# EAGLE design 808_CY (EAGLE 7.1.0)
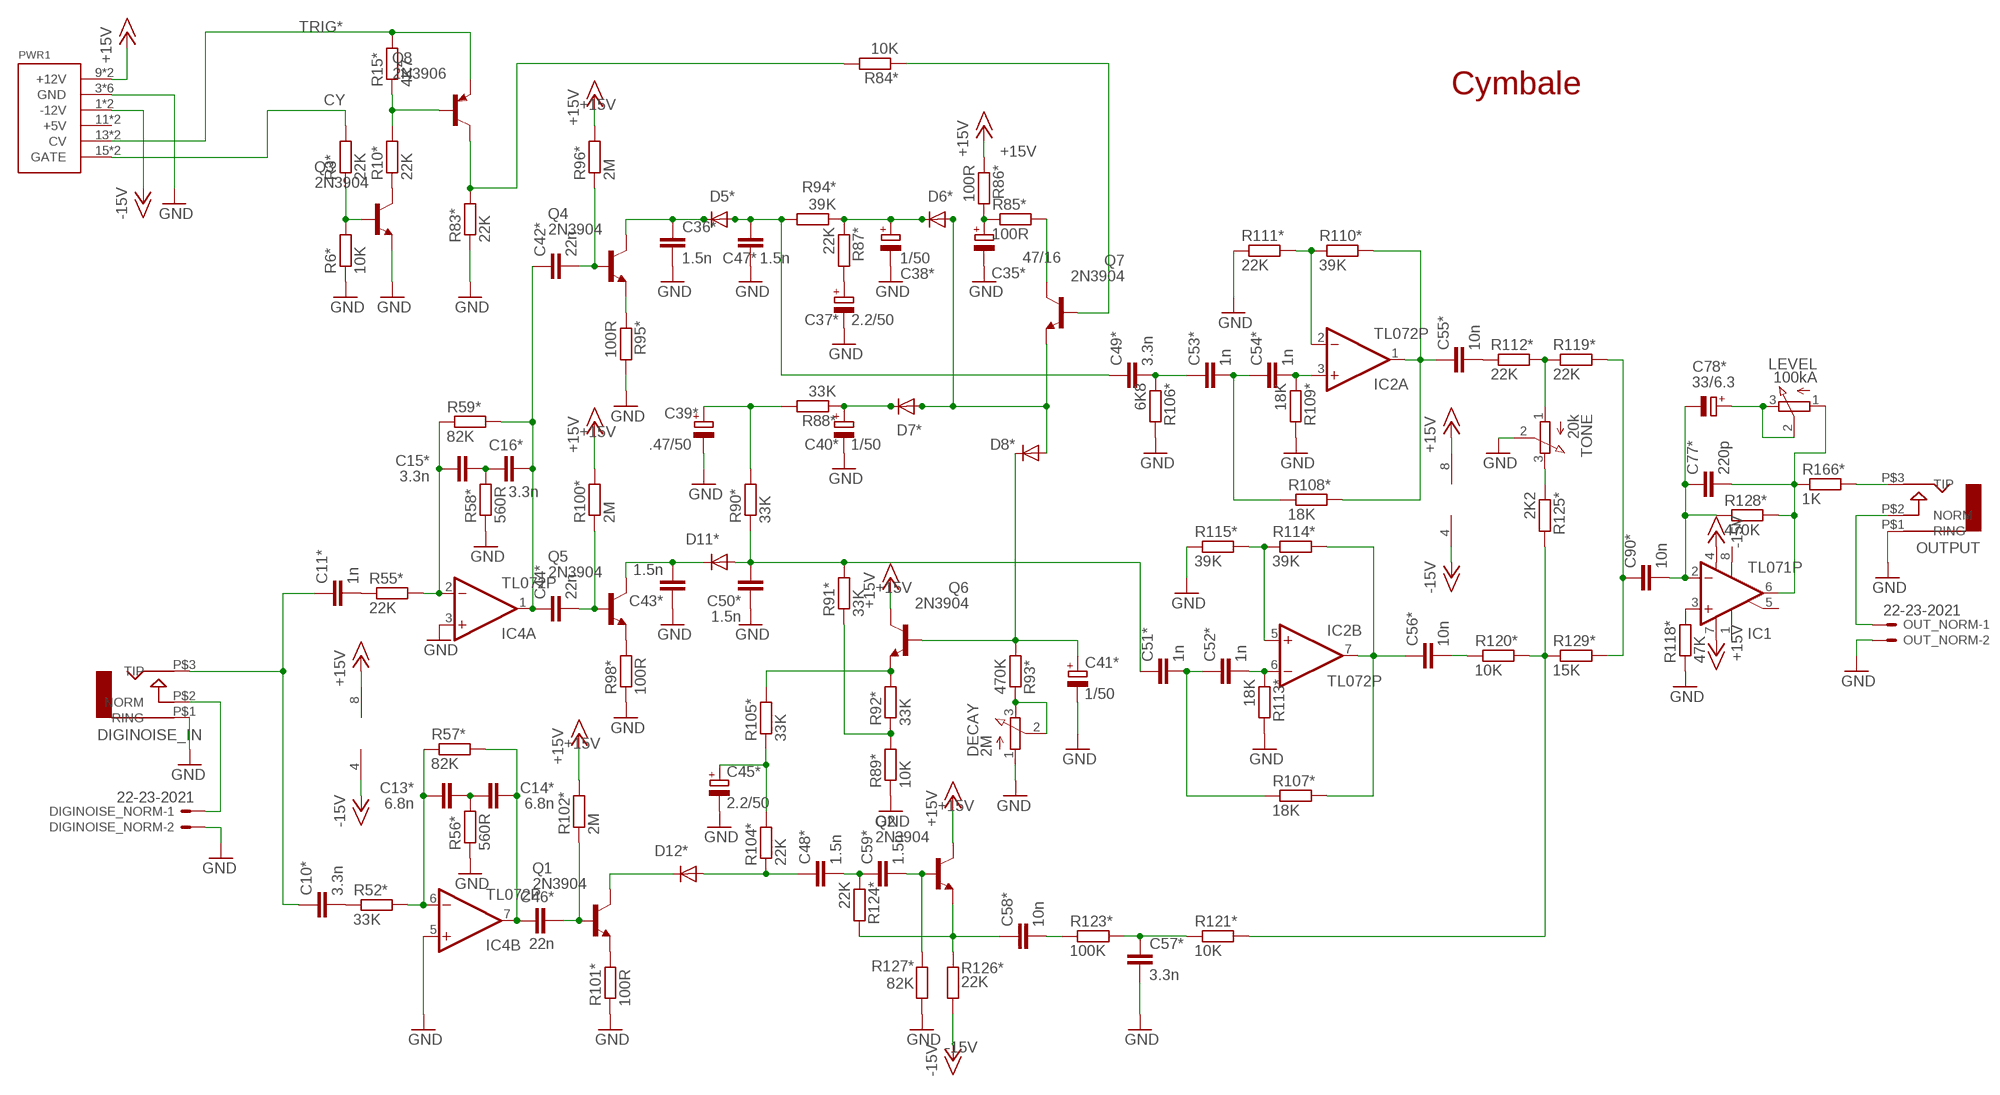
[diagram p0: schematic, sheet 1]

## Parts
C10*  3.3n  C-EU3.5MM_PITCH  [C035-025X75]
C11*  1n  C-EU3.5MM_PITCH  [C035-025X75]
C13*  6.8n  C-EU4MM_PITCH  [C035-030X60]
C14*  6.8n  C-EU4MM_PITCH  [C035-030X60]
C15*  3.3n  C-EU3.5MM_PITCH  [C035-025X75]
C16*  3.3n  C-EU3.5MM_PITCH  [C035-025X75]
C35*  47/16  CPOL-EUE2.5-5  [E2,5-5]
C36*  1.5n  C-EU3.5MM_PITCH  [C035-025X75]
C37*  2.2/50  CPOL-EUE2.5-5  [E2,5-5]
C38*  1/50  CPOL-EUE2.5-5  [E2,5-5]
C39*  .47/50  CPOL-EUE2.5-5  [E2,5-5]
C40*  1/50  CPOL-EUE2.5-5  [E2,5-5]
C41*  1/50  CPOL-EUE3.5-8  [E3,5-8]
C42*  22n  C-EU050-024X044  [C050-024X044]
C43*  1.5n  C-EU3.5MM_PITCH  [C035-025X75]
C44*  22n  C-EU050-024X044  [C050-024X044]
C45*  2.2/50  CPOL-EUE2.5-5  [E2,5-5]
C46*  22n  C-EU050-024X044  [C050-024X044]
C47*  1.5n  C-EU050-035X075  [C050-035X075]
C48*  1.5n  C-EU3.5MM_PITCH  [C035-025X75]
C49*  3.3n  C-EU3.5MM_PITCH  [C035-025X75]
C50*  1.5n  C-EU3.5MM_PITCH  [C035-025X75]
C51*  1n  C-EU3.5MM_PITCH  [C035-025X75]
C52*  1n  C-EU3.5MM_PITCH  [C035-025X75]
C53*  1n  C-EU3.5MM_PITCH  [C035-025X75]
C54*  1n  C-EU3.5MM_PITCH  [C035-025X75]
C55*  10n  C-EU050-030X075  [C050-030X075]
C56*  10n  C-EU3.5MM_PITCH  [C035-025X75]
C57*  3.3n  C-EU3.5MM_PITCH  [C035-025X75]
C58*  10n  C-EU3.5MM_PITCH  [C035-025X75]
C59*  1.5n  C-EU3.5MM_PITCH  [C035-025X75]
C77*  220p  C-EU025-025X050  [C025-025X050]
C78*  33/6.3  CPOL-EUE3.5-8  [E3,5-8]
C90*  10n  C-EU3.5MM_PITCH  [C035-025X75]
D5*  1N4148DO35-10  [DO35-10]
D6*  1N4148DO35-7  [DO35-7]
D7*  1N4148DO35-7  [DO35-7]
D8*  1N4148DO35-7  [DO35-7]
D11*  1N4148DO35-7  [DO35-7]
D12*  1N4148DO35-7  [DO35-7]
DECAY  2M  3RP/1610N  [3RP/1610N]
DIGINOISE_IN  AUDIO-JACK  [ERTHENVAR-JACK-90DEG]
DIGINOISE_NORM  22-23-2021  [22-23-2021]
IC1  TL071P  [DIL08]
IC2  TL072P  [DIL08]
IC4  TL072P  [DIL08]
LEVEL  100kA  3RP/1610N  [3RP/1610N]
OUT_NORM  22-23-2021  [22-23-2021]
OUTPUT  AUDIO-JACK  [ERTHENVAR-JACK-90DEG]
PWR1  POWER  [POWER_16]
Q1  2N3904  [TO92]
Q2  2N3904  [TO92]
Q3  2N3904  [TO92]
Q4  2N3904  [TO92]
Q5  2N3904  [TO92]
Q6  2N3904  [TO92]
Q7  2N3904  [TO92]
Q8  2N3906  [TO92]
R3*  22K  R-EU_0207/5V  [0207/5V]
R6*  10K  R-EU_0207/5V  [0207/5V]
R10*  22K  R-EU_0207/5V  [0207/5V]
R15*  4K7  R-EU_0207/5V  [0207/5V]
R52*  33K  R-EU_0207/5V  [0207/5V]
R55*  22K  R-EU_0207/7  [0207/7]
R56*  560R  R-EU_0207/5V  [0207/5V]
R57*  82K  R-EU_0207/5V  [0207/5V]
R58*  560R  R-EU_0207/7  [0207/7]
R59*  82K  R-EU_0207/2V  [0207/2V]
R83*  22K  R-EU_0207/5V  [0207/5V]
R84*  10K  R-EU_0207/7  [0207/7]
R85*  100R  R-EU_0207/7  [0207/7]
R86*  100R  R-EU_0207/7  [0207/7]
R87*  22K  R-EU_0207/5V  [0207/5V]
R88*  33K  R-EU_0207/5V  [0207/5V]
R89*  10K  R-EU_0207/7  [0207/7]
R90*  33K  R-EU_0207/5V  [0207/5V]
R91*  33K  R-EU_0207/7  [0207/7]
R92*  33K  R-EU_0207/7  [0207/7]
R93*  470K  R-EU_0207/7  [0207/7]
R94*  39K  R-EU_0207/5V  [0207/5V]
R95*  100R  R-EU_0207/7  [0207/7]
R96*  2M  R-EU_0207/5V  [0207/5V]
R98*  100R  R-EU_0207/7  [0207/7]
R100*  2M  R-EU_0207/7  [0207/7]
R101*  100R  R-EU_0207/7  [0207/7]
R102*  2M  R-EU_0207/7  [0207/7]
R104*  22K  R-EU_0207/5V  [0207/5V]
R105*  33K  R-EU_0309/10  [0309/10]
R106*  6K8  R-EU_0207/5V  [0207/5V]
R107*  18K  R-EU_0207/5V  [0207/5V]
R108*  18K  R-EU_0207/5V  [0207/5V]
R109*  18K  R-EU_0207/7  [0207/7]
R110*  39K  R-EU_0207/7  [0207/7]
R111*  22K  R-EU_0207/7  [0207/7]
R112*  22K  R-EU_0207/5V  [0207/5V]
R113*  18K  R-EU_0207/7  [0207/7]
R114*  39K  R-EU_0207/5V  [0207/5V]
R115*  39K  R-EU_0207/7  [0207/7]
R118*  47K  R-EU_0207/5V  [0207/5V]
R119*  22K  R-EU_0207/5V  [0207/5V]
R120*  10K  R-EU_0207/5V  [0207/5V]
R121*  10K  R-EU_0207/7  [0207/7]
R123*  100K  R-EU_0207/7  [0207/7]
R124*  22K  R-EU_0207/5V  [0207/5V]
R125*  2K2  R-EU_0207/5V  [0207/5V]
R126*  22K  R-EU_0207/7  [0207/7]
R127*  82K  R-EU_0207/5V  [0207/5V]
R128*  470K  R-EU_0207/5V  [0207/5V]
R129*  15K  R-EU_0207/5V  [0207/5V]
R166*  1K  R-EU_0207/7  [0207/7]
TONE  20k  3RP/1610N  [3RP/1610N]

## Nets
+15V: IC1.7(V+) IC2.8(P:V+) IC4.8(P:V+) PWR1.9(+12V) PWR1.10(+12V) Q2.1(C) Q6.1(C) R86*.1 R96*.2 R100*.2 R102*.2
-15V: IC1.4(V-) IC2.4(P:V-) IC4.4(P:V-) PWR1.1(-12V) PWR1.2(-12V) R126*.2
CY: PWR1.15(GATE) PWR1.16(GATE) R3*.2
GND [GND]: C35*.- C36*.P$2 C37*.- C38*.- C39*.- C40*.- C41*.- C43*.P$1 C45*.- C47*.2 C50*.P$1 C57*.P$2 DECAY.1(A) DIGINOISE_IN.P$1(RING) DIGINOISE_NORM.2 IC4.3(A:+IN) IC4.5(B:+IN) OUT_NORM.2 OUTPUT.P$1(RING) PWR1.3(GND) PWR1.4(GND) PWR1.5(GND) PWR1.6(GND) PWR1.7(GND) PWR1.8(GND) Q3.3(E) R6*.1 R56*.1 R58*.1 R83*.1 R89*.1 R95*.2 R98*.1 R101*.1 R106*.2 R109*.2 R111*.1 R113*.2 R115*.1 R118*.1 R127*.2 TONE.2(S)
LT_LC_OUT1: C10*.P$1 C11*.P$1 DIGINOISE_IN.P$3(TIP)
N$1: Q5.3(E) R98*.2
N$2: Q1.3(E) R101*.2
N$3: Q3.1(C) R10*.1
N$4: IC1.3(+IN) R118*.2
N$5: OUT_NORM.1 OUTPUT.P$2(NORM)
N$6: DIGINOISE_IN.P$2(NORM) DIGINOISE_NORM.1
N$7: OUTPUT.P$3(TIP) R166*.2
N$171: C78*.+ LEVEL.2(S) LEVEL.3(E)
N$177: C58*.P$1 Q2.3(E) R124*.2 R126*.1
N$178: DECAY.2(S) DECAY.3(E) R93*.1
N$216: Q4.3(E) R95*.1
N$223: C50*.P$2 C51*.P$1 D11*.A R90*.1 R91*.2
N$495: C11*.P$2 R55*.1
N$496: C15*.P$1 IC4.2(A:-IN) R55*.2 R59*.1
N$498: C44*.2 Q5.2(B) R100*.1
N$500: C43*.P$2 D11*.C Q5.1(C)
N$501: C39*.+ R88*.2 R90*.2
N$502: C10*.P$2 R52*.1
N$503: C13*.P$1 IC4.6(B:-IN) R52*.2 R57*.1
N$504: C14*.P$2 C46*.1 IC4.7(B:OUT) R57*.2
N$505: C46*.2 Q1.2(B) R102*.1
N$507: D12*.C Q1.1(C)
N$508: C48*.P$1 D12*.A R104*.1
N$510: C40*.+ D7*.C R88*.1
N$511: C35*.+ R85*.1 R86*.2
N$512: Q7.1(C) R85*.2
N$513: D6*.A D7*.A D8*.A Q7.3(E)
N$514: Q7.2(B) R84*.1
N$515: Q8.1(C) R83*.2 R84*.2
N$516: Q8.2(B) R10*.2 R15*.1
N$517: Q3.2(B) R3*.1 R6*.2
N$522: C36*.P$1 D5*.C Q4.1(C)
N$523: C47*.1 C49*.P$1 D5*.A R94*.2
N$524: C42*.2 Q4.2(B) R96*.1
N$526: C37*.+ R87*.2
N$527: Q6.3(E) R92*.2 R105*.2
N$528: R89*.2 R91*.1 R92*.1
N$529: C41*.+ D8*.C Q6.2(B) R93*.2
N$530: C49*.P$2 C53*.P$1 R106*.1
N$531: C54*.P$2 IC2.3(A:+IN) R109*.1
N$532: R112*.2 R119*.1 TONE.1(A)
N$533: C55*.1 IC2.1(A:OUT) R108*.2 R110*.2
N$534: C53*.P$2 C54*.P$1 R108*.1
N$535: IC2.2(A:-IN) R110*.1 R111*.2
N$536: C55*.2 R112*.1
N$537: R125*.1 TONE.3(E)
N$538: C52*.P$2 IC2.6(B:-IN) R113*.1
N$539: C56*.P$1 IC2.7(B:OUT) R107*.2 R114*.2
N$540: C51*.P$2 C52*.P$1 R107*.1
N$541: IC2.5(B:+IN) R114*.1 R115*.2
N$544: C77*.1 C78*.- C90*.P$2 IC1.2(-IN) R128*.1
N$546: C77*.2 IC1.6(OUT) LEVEL.1(A) R128*.2 R166*.1
N$547: C56*.P$2 R120*.1
N$548: R120*.2 R121*.2 R125*.2 R129*.1
N$549: C90*.P$1 R119*.2 R129*.2
N$550: C48*.P$2 C59*.P$1 R124*.1
N$551: C59*.P$2 Q2.2(B) R127*.1
N$553: C58*.P$2 R123*.1
N$554: C57*.P$1 R121*.1 R123*.2
N$556: C15*.P$2 C16*.P$1 R58*.2
N$557: C13*.P$2 C14*.P$1 R56*.2
N$558: C45*.+ R104*.2 R105*.1
N$561: C38*.+ D6*.C R87*.1 R94*.1
TO_HH: C16*.P$2 C42*.1 C44*.1 IC4.1(A:OUT) R59*.2
TRIG*: PWR1.13(CV) PWR1.14(CV) Q8.3(E) R15*.2
Unconnected: IC1.1(ON1) IC1.5(ON2) IC1.8(OPT) PWR1.11(+5V) PWR1.12(+5V)

## Notes on the sheet
- Cymbale

## Library data of the parts
C10* C11* C13* C14* C15* C16* C36* C42* C43* C44* C46* C47* C48* C49* C50* C51* C52* C53* C54* C55* C56* C57* C58* C59* C77* C90* = TR808clone:C-EU: CAPACITOR, European symbol Pitch 3mm
C35* C37* C38* C39* C40* C41* C45* C78* = TR808clone:CPOL-EU: POLARIZED CAPACITOR, European symbol
D5* D6* D7* D8* D11* D12* = TR808clone:1N4148: DIODE high speed (Philips)
DECAY LEVEL TONE = pot:3RP/1610N: 16mm Potentiometer one level Source: http://www.alphapotentiometers.net/html/16mm_pot_2.html
DIGINOISE_IN OUTPUT = erthenvar:AUDIO-JACK: Switching Mono 3.5mm Audio Jack from Erthenvar.
DIGINOISE_NORM OUT_NORM = con-molex:22-23-2021: .100" (2.54mm) Center Header - 2 Pin; MF: MOLEX; MPN: 22-23-2021; OC_FARNELL: 1462926; OC_NEWARK: 25C3832
IC1 = linear:TL071: OP AMP
IC2 IC4 = linear:TL072: OP AMP
PWR1 = eurorack:POWER
Q1-Q7 = transistor-npn:2N3904: NPN Transistor
Q8 = transistor-pnp:2N3906: PNP Transistor
R3* R6* R10* R15* R52* R55* R56* R57* R58* R59* R83* R84* R85* R86* R87* R88* R89* R90* R91* R92* R93* R94* R95* R96* R98* R100* R101* R102* R104* R105* R106* R107* R108* R109* R110* R111* R112* R113* R114* R115* R118* R119* R120* R121* R123* R124* R125* R126* R127* R128* R129* R166* = TR808clone:R-EU_: RESISTOR, European symbol

## Net classes
0 default: width 0.635 mm, drill 0.254 mm, clearance 0.254 mm
1 GND: width 1.016 mm, drill 1.016 mm, clearance 0.508 mm
2 Power: width 1.016 mm, drill 1.016 mm, clearance 0.508 mm

## Board
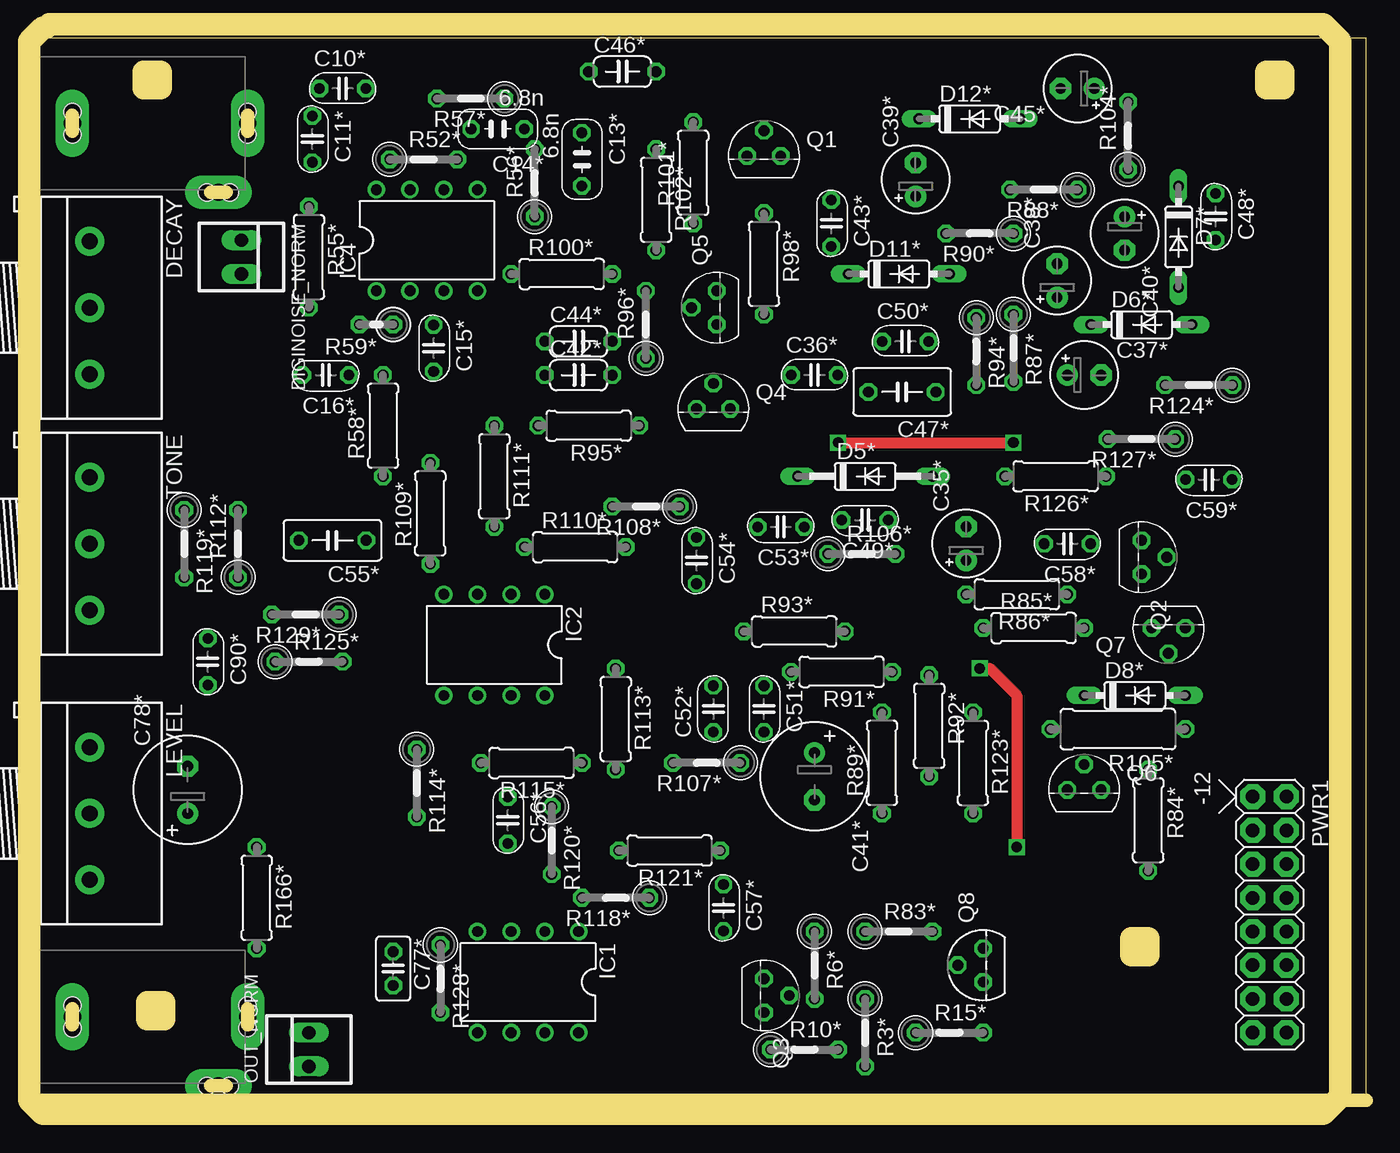
[diagram p1: board, top side]
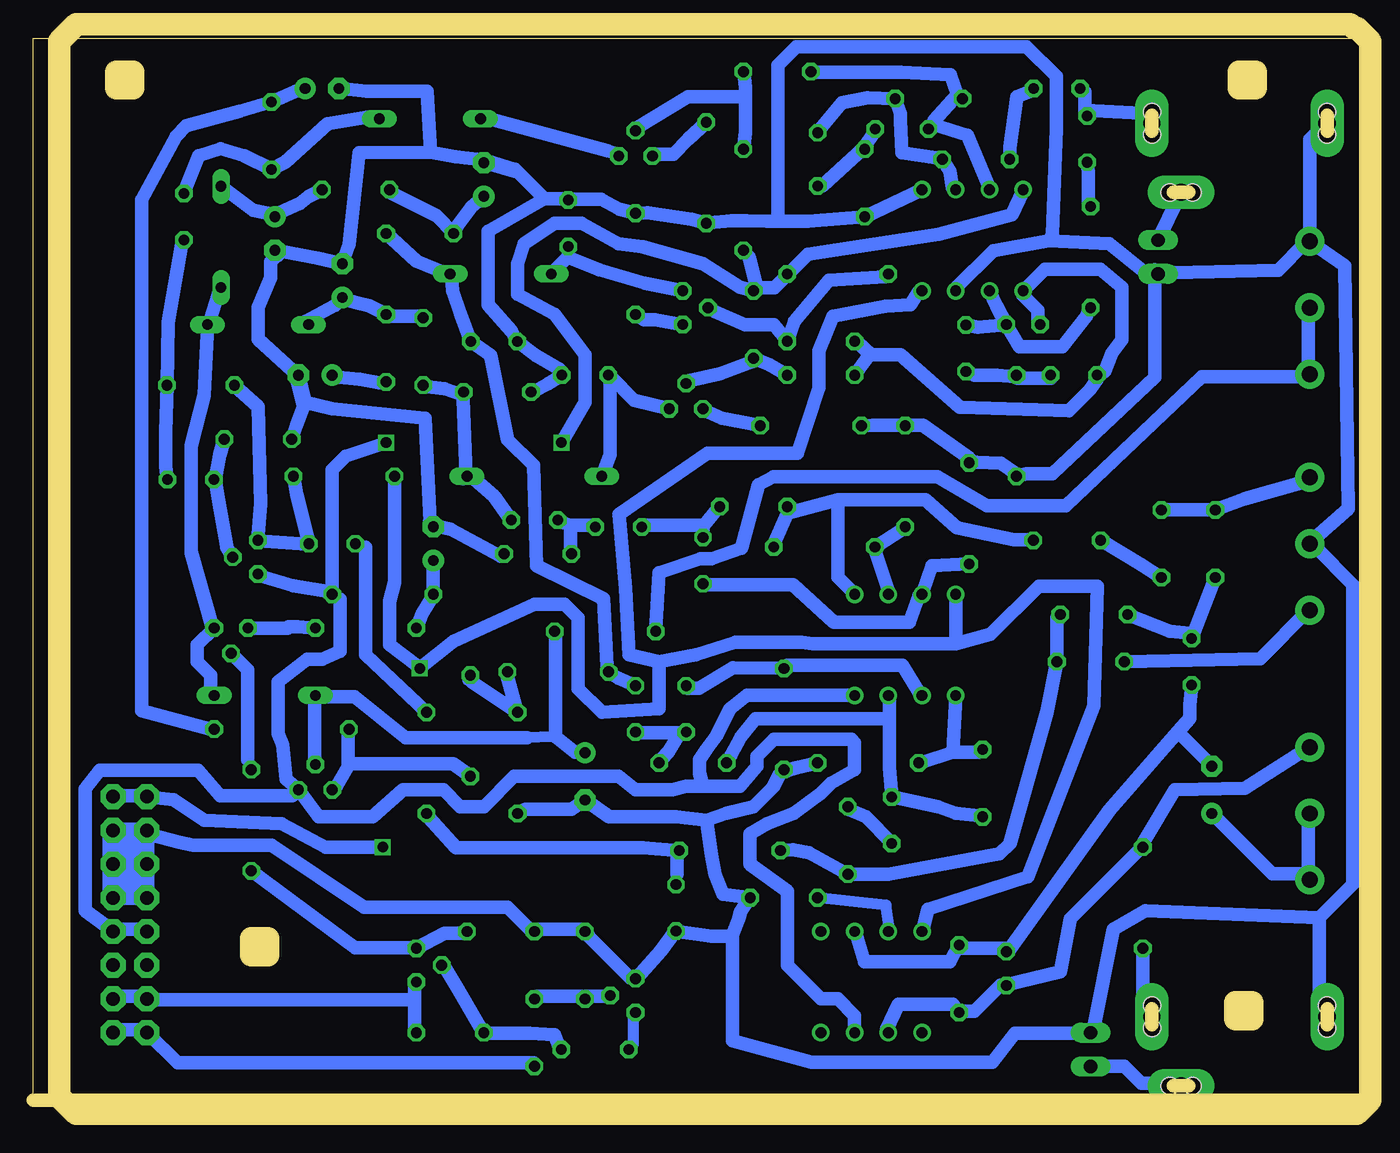
[diagram p2: board, bottom side, seen from below]

Size 100 x 80 mm. Coordinates in mm from the lower left corner, seen from the top.
Outline: 0,0 100,0 100,80 0,80 0,0
Copper layers (1*16): Top 0.035mm / dielectric 1.5mm / Bottom 0.035mm
Design rules "default *": minimum track width 28mil, minimum drill 31mil, track to track 16mil, track to pad 16mil, pad to pad 16mil, via to via 16mil, smd to smd 8mil, copper to edge 0mil, drill to drill 16mil, minimum pad ring 10mil, minimum via ring 8mil, stop-mask expansion 4mil, vias tented up to drill 0mil, thermal gap 10mil
Milling: 26 lines

### Footprints (pad centres in the part's own frame; a part is rotated, then mirrored left to right if it is on the bottom)
C035-025X75 = drill 0.8 octagon: P$1 -1.75,0; P$2 1.75,0
C035-030X60 = drill 0.8 octagon: P$1 -2,0; P$2 2,0
E2,5-5 = drill 0.813 pad 1.6: + -1.27,0 | drill 0.813 pad 1.6 octagon: - 1.27,0
E3,5-8 = drill 0.813 pad 1.6: + -1.778,0 | drill 0.813 pad 1.6 octagon: - 1.778,0
C050-024X044 = drill 0.813 octagon: 1 -2.54,0; 2 2.54,0
C050-035X075 = drill 0.813 octagon: 1 -2.54,0; 2 2.54,0
C050-030X075 = drill 0.813 octagon: 1 -2.54,0; 2 2.54,0
C025-025X050 = drill 0.813 octagon: 1 -1.27,0; 2 1.27,0
DO35-10 = drill 0.813 long: A 5.08,0; C -5.08,0
DO35-7 = drill 0.813 long: A 3.81,0; C -3.81,0
3RP/1610N = drill 1.2 pad 2.184: 1 -5,0; 2 0,0; 3 5,0
ERTHENVAR-JACK-90DEG = drill 1.3 pad 2.54 long: P$1 5,-2.5; P$2 -0.2,-13.5; P$3 5,-15.7 | hole 1.3: 5.842,-2.489; 4.14,-2.489; -0.203,-12.649; -0.203,-14.351; 5.842,-15.697; 4.166,-15.697
22-23-2021 = drill 1 long: 1 -1.27,0; 2 1.27,0
DIL08 = drill 0.813 pad 1.27: 1 -3.81,-3.81; 2 -1.27,-3.81; 3 1.27,-3.81; 4 3.81,-3.81; 5 3.81,3.81; 6 1.27,3.81; 7 -1.27,3.81; 8 -3.81,3.81
POWER_16 = drill 1.016 pad 1.88 octagon: 1 -6.35,-1.27; 2 -6.35,1.27; 3 -3.81,-1.27; 4 -3.81,1.27; 5 -1.27,-1.27; 6 -1.27,1.27; 7 1.27,-1.27; 8 1.27,1.27; 9 3.81,-1.27; 10 3.81,1.27; 11 6.35,-1.27; 12 6.35,1.27; 13 8.89,-1.27; 14 8.89,1.27; 15 11.43,-1.27; 16 11.43,1.27
TO92 = drill 0.813 octagon: 1 1.27,0; 2 0,1.905; 3 -1.27,0
0207/5V = drill 0.813 octagon: 1 -2.54,0; 2 2.54,0
0207/7 = drill 0.813 octagon: 1 -3.81,0; 2 3.81,0
0207/2V = drill 0.813 octagon: 1 -1.27,0; 2 1.27,0
0309/10 = drill 0.813 octagon: 1 -5.08,0; 2 5.08,0

### Placement (x,y rotation side)
C10*  22.86,76.2 0 top
C11*  20.57,72.39 270 top
C13*  40.89,70.87 270 top
C14*  34.54,73.15 180 top
C15*  29.72,56.64 270 top
C16*  21.59,54.61 180 top
C35*  69.85,41.91 90 top
C36*  58.42,54.61 0 top
C37*  78.74,54.61 0 top
C38*  76.71,61.72 90 top
C39*  66.04,69.34 90 top
C40*  81.79,65.28 270 top
C41*  58.42,24.38 270 top
C42*  40.64,54.61 0 top
C43*  59.69,66.04 270 top
C44*  40.64,57.15 0 top
C45*  78.23,76.2 180 top
C46*  43.94,77.47 0 top
C47*  65.02,53.34 180 top
C48*  88.65,66.55 270 top
C49*  62.23,43.69 180 top
C50*  65.28,57.15 0 top
C51*  54.61,29.46 270 top
C52*  50.8,29.46 90 top
C53*  55.88,43.18 180 top
C54*  49.53,40.64 270 top
C55*  22.1,42.16 180 top
C56*  35.31,21.08 270 top
C57*  51.56,14.48 270 top
C58*  77.47,41.91 180 top
C59*  88.14,46.74 180 top
C77*  26.67,9.91 270 top
C78*  11.18,23.37 90 top
C90*  12.7,33.02 270 top
D5*  62.23,46.99 0 top
D6*  83.06,58.42 0 top
D7*  85.85,65.02 270 top
D8*  82.55,30.48 0 top
D11*  64.77,62.23 0 top
D12*  70.1,73.91 0 top
DECAY  3.81,59.69 270 top
DIGINOISE_IN  0,68.58 90 top
DIGINOISE_NORM  15.24,63.5 270 top
IC1  36.83,8.89 180 top
IC2  34.29,34.29 180 top
IC4  29.21,64.77 0 top
LEVEL  3.81,21.59 270 top
OUT_NORM  20.32,3.81 90 top
OUTPUT  0,1.27 90 top
PWR1  92.71,16.51 270 top
Q1  54.61,71.12 0 top
Q2  83.06,40.89 270 top
Q3  54.61,7.87 270 top
Q4  50.8,52.07 0 top
Q5  51.05,59.69 90 top
Q6  78.74,23.37 0 top
Q7  85.09,35.56 180 top
Q8  71.12,10.16 90 top
R3*  62.23,5.08 270 top
R6*  58.42,10.16 270 top
R10*  57.66,3.81 0 top
R15*  68.58,5.08 0 top
R52*  28.96,70.87 0 top
R55*  20.32,63.5 270 top
R56*  37.34,69.09 90 top
R57*  32.51,75.44 180 top
R58*  25.91,50.8 90 top
R59*  25.4,58.42 180 top
R83*  64.77,12.7 0 top
R84*  83.57,21.08 270 top
R85*  74.93,35.56 0 top
R86*  73.66,38.1 180 top
R87*  73.41,56.64 270 top
R88*  75.69,68.58 180 top
R89*  63.5,25.4 90 top
R90*  70.87,65.28 180 top
R91*  60.45,32.26 180 top
R92*  67.06,28.19 270 top
R93*  56.9,35.31 0 top
R94*  70.61,56.39 270 top
R95*  41.4,50.8 180 top
R96*  45.72,58.42 90 top
R98*  54.61,62.99 270 top
R100*  39.37,62.23 0 top
R101*  49.28,69.85 90 top
R102*  46.48,67.82 270 top
R104*  82.04,72.64 90 top
R105*  81.28,27.94 180 top
R106*  61.98,41.15 0 top
R107*  50.29,25.4 180 top
R108*  45.72,44.7 180 top
R109*  29.46,44.2 90 top
R110*  40.39,41.66 0 top
R111*  34.29,46.99 270 top
R112*  14.99,41.91 90 top
R113*  43.43,28.7 270 top
R114*  28.45,23.88 270 top
R115*  37.08,25.4 180 top
R118*  43.43,15.24 180 top
R119*  10.92,41.91 270 top
R120*  38.61,19.56 270 top
R121*  47.5,18.8 180 top
R123*  70.36,25.4 270 top
R124*  87.38,53.85 180 top
R125*  20.32,33.02 0 top
R126*  76.58,46.99 180 top
R127*  83.06,49.78 180 top
R128*  30.23,9.14 270 top
R129*  20.07,36.58 180 top
R166*  16.38,15.24 270 top
TONE  3.81,41.91 270 top

### Tracks (layer width: path | path; a pad name or v marks a point on that pad's centre or on a via)
+15V  (via drill 0.8)
  Top 0.813: v60.2,49.53 v73.41,49.53
  Bottom 0.711: 25.43,68.45 IC4.8 | 43.03,62.31 R100*.2 43.31,62.03 | 45.54,61.19 R96*.2 45.54,61.47 | 46.05,63.52 R102*.2 | 91.64,12.85 PWR1.9 | 93.88,12.85 PWR1.10 94.16,12.85 | 76.86,37.72 77.39,38 R86*.1 77.67,38.28
  Bottom 0.813: 38.35,30.48 IC2.8
  Bottom 1.016: 25.43,68.45 26.24,66.67 31.75,65.23 41.63,63.7 43.03,62.31 | 45.54,61.19 44.15,61.19 43.31,62.03 | 45.54,61.47 46.05,63.52 | 93.88,12.85 91.64,12.85 | 76.86,37.72 76.86,33.81 78.23,33.2 79.35,33.2 81.53,31.52 81.53,27.61 81.2,26.77 80.95,24.18 Q6.1 | 77.67,38.28 80.42,38.73 82.93,39.5 Q2.1 | 94.16,12.85 96.09,14.28 96.09,23.47 94.97,24.84 87.55,24.84 85.9,22.94 80.47,22.94 Q6.1 | IC1.7 38.1,6.35 39.37,7.62 40.64,7.62 43.18,10.16 43.18,15.75 45.97,17.78 45.97,20.07 44.7,20.83 42.67,21.59 40.64,23.11 39.88,23.88 38.1,24.89 38.1,26.92 38.35,27.18 44.2,27.18 45.47,25.91 45.47,25.15 46.74,23.62 49.53,23.62 | 49.53,23.62 49.78,24.64 49.78,25.65 49.28,26.42 48.51,27.43 47.5,29.46 46.23,30.48 38.35,30.48 | R96*.2 46.74,61.21 49.53,62.99 54.1,64.26 55.88,64.52 58.67,66.04 60.71,66.04 62.99,64.52 63.5,62.99 63.5,60.71 60.71,59.18 58.42,56.13 58.42,52.58 v60.2,49.53 | v73.41,49.53 76.45,48.51 77.47,47.5 R86*.1 | 49.53,23.62 50.8,23.62 51.82,23.37 54.61,23.37 55.88,24.38 63.75,24.38 66.04,22.1 67.82,22.1 69.09,23.37 72.14,23.37 74.42,21.34 78.49,21.34 Q6.1
-15V  (via drill 0.8)
  Top 0.813: v70.87,32.51 71.63,32.51 73.66,30.48 v73.66,19.05
  Bottom 0.711: 91.64,22.91 PWR1.1 | 93.88,22.91 PWR1.2 | 30.45,38 IC2.4 | 32.97,12.85 IC1.4 | 33.25,60.91 IC4.4
  Bottom 0.813: 71.12,32.77 v70.87,32.51
  Bottom 1.016: 93.88,22.91 91.64,22.91 | 30.45,34.37 27.86,35.08 24.23,38.71 19.81,38.71 20.07,29.72 25.04,16.82 32.56,14.38 32.97,12.85 | 30.45,34.37 30.45,38 | 33.25,60.91 33.88,59.89 35.76,59.79 39.73,59.03 40.79,56.44 40.79,53.65 42.39,48.74 49.2,48.74 55.85,44.12 55.35,38.56 55.12,33.53 52.83,33.02 | 30.45,34.37 41.22,34.37 42.11,34.49 47.07,34.49 50.04,33.55 52.83,33.02 | v70.87,32.51 68.33,34.54 62.23,37.34 59.94,37.34 58.93,36.32 58.93,30.99 57.15,29.21 52.83,29.46 52.83,33.02 | v73.66,19.05 77.98,19.05 81.28,20.83 87.12,21.08 89.41,22.61 PWR1.1 | R126*.2 72.77,38.99 73.15,37.59 73.15,34.29 71.12,32.77
CY
  Bottom 0.711: 62.31,2.79 R3*.2 | 91.36,5.03 PWR1.15 91.64,5.31 | 93.88,5.31 PWR1.16
  Bottom 1.016: 62.31,2.79 89.13,2.79 91.36,5.03 | 91.64,5.31 93.88,5.31
GND
  Bottom 0.813: 3.07,6.84 OUTPUT.P$1 | 2.54,73.66 2.54,73.62 DIGINOISE_IN.P$1
  Bottom 1.016: PWR1.5 91.36,17.6 91.36,15.37 PWR1.7 91.92,15.37 93.88,15.37 PWR1.8 | PWR1.6 93.88,17.88 91.92,17.88 PWR1.5 | PWR1.3 91.36,20.12 91.36,18.16 PWR1.5 | PWR1.4 93.88,20.4 91.92,20.4 PWR1.3 | R89*.1 62.92,21.89 59.44,21.89 C41*.- 56.59,21.36 51.56,21.36 49.26,21.09 | 42.47,25.02 43.43,24.77 R113*.2 | 42.47,25.02 41.5,25.27 R115*.1 | 47.3,12.34 48.87,12.34 C57*.P$2 51.69,12.65 52.7,11.25 54.48,9.22 Q3.3 55.04,9.22 58.12,12.29 R6*.1 58.67,12.85 62.03,12.85 R83*.1 62.59,12.85 64.26,14.53 75.06,14.53 82.02,19.2 87.94,19.2 89,19.41 91.85,20.17 PWR1.3 | 47.3,12.34 47.3,12.45 46.81,13.69 46.71,14.2 R118*.1 48.01,15.49 48.64,17.02 48.9,18.44 49.26,21.09 | 47.3,12.34 47.3,4.47 41.35,2.85 27.71,2.85 26.04,5.03 20.4,5.03 OUT_NORM.2 20.12,5.31 18.59,12.88 16.2,14.25 3.07,13.74 | 42.47,25.02 43.74,24.59 44.25,23.57 45.72,22.1 47.75,21.59 49.26,21.09 | DECAY.1 3.63,64.54 1.17,62.84 0.91,44.55 3.38,42.34 3.63,41.91 TONE.2 3.35,41.63 0.56,38.84 0.56,16.26 3.07,13.74 | R95*.2 36.73,50.85 34.37,50.85 R111*.1 33.81,50.85 32.97,50.85 29.46,48.36 R109*.2 28.93,48.06 27.08,47.98 25.98,47.22 R58*.1 25.17,47.19 23.22,47.19 15.47,54.43 15.47,62.53 DIGINOISE_NORM.2 | 23.47,64.75 18.9,64.49 16.2,62.31 15.37,62.31 DIGINOISE_NORM.2 | 23.47,64.75 27.66,63.98 30.45,61.19 IC4.3 | DECAY.1 4.19,64.54 6.17,62.51 14.25,62.31 14.81,62.31 DIGINOISE_NORM.2 | 81.31,63.93 78.51,63.42 C38*.- 76.2,64.47 75.44,71.37 70.07,71.41 | 81.31,63.93 81.53,63.65 C40*.- | R106*.2 64.8,40.97 68.53,43 69.85,43.31 C35*.- 70.13,43.59 70.08,43.59 70.48,51.36 77.47,52.07 79.5,52.58 C37*.- | C37*.- 80.19,54.48 79.63,52.25 80.14,50.88 R127*.2 80.37,49.84
  Bottom 1.016: 81.31,63.93 82.09,63.14 82.09,61.95 83.06,59.72 83.06,57.3 80.49,54.99 C37*.- | 43.87,66.22 44.7,66.22 46.25,66.24 47.4,66.24 49.07,66.09 R101*.1 50.39,66.34 53.72,66.85 R98*.1 55.8,67.11 57.2,67.87 59.23,67.87 C43*.P$1 59.79,67.89 61.47,67.89 | 43.87,66.22 41.63,66.22 R56*.1 IC4.5 | C47*.2 62.31,53.37 61.19,53.98 60.35,54.48 C36*.P$2 60.35,55.04 62.13,56.11 C50*.P$1 63.96,57.91 65.71,59.92 65.71,65.43 61.47,67.89 | 61.47,67.89 63.42,69.85 C39*.- 63.7,70.13 65.89,70.79 68.17,71.04 70.07,71.41 | 70.07,71.41 70.33,76 74.88,76 C45*.- | 23.47,64.75 23.22,65.23 22.91,73.15 22.91,77.11 25.15,79.35 42.47,79.35 43.87,77.95 43.87,66.22 | 3.07,13.74 3.07,6.84 | DECAY.1 3.81,72.39 2.54,73.66
LT_LC_OUT1
  Bottom 0.711: 20.75,75.97 21.23,76 C10*.P$1 | 20.75,74.57 C11*.P$1
  Bottom 0.813: 16.44,74.32 DIGINOISE_IN.P$3
  Bottom 1.016: 20.75,75.97 20.75,74.57 16.44,74.32
N$1
  Bottom 1.016: Q5.3 53.14,58.78 53.98,58.78 R98*.2
N$2
  Bottom 0.711: 53.09,71.25 Q1.3
  Bottom 1.016: 53.09,71.25 51.77,71.25 50.65,72.36 R101*.2
N$3
  Bottom 0.711: 54.76,4.19 55.04,3.91 R10*.1 | 54.76,6.43 Q3.1
  Bottom 0.813: 54.76,4.19 54.76,6.43
N$4
  Bottom 0.711: 35.48,12.85 IC1.3
  Bottom 0.813: 35.48,12.85 35.74,14.68 R118*.2
N$5
  Bottom 0.813: 13.7,1.27 OUTPUT.P$2
  Bottom 1.016: OUT_NORM.1 17.78,2.54 16.51,1.27 13.7,1.27
N$6
  Bottom 1.016: DIGINOISE_NORM.1 14.48,66.39 DIGINOISE_IN.P$2
N$7
  Bottom 0.813: 16.38,6.95 OUTPUT.P$3
  Bottom 1.016: R166*.2 16.38,6.95
N$171
  Bottom 0.711: 4.19,17.04 3.91,16.76 LEVEL.3 | 11.18,21.36 C78*.+ | 3.91,21.51 LEVEL.2
  Bottom 1.016: 3.91,21.51 3.91,17.04 LEVEL.3 | 4.19,17.04 6.63,17.04 C78*.+
N$177
  Bottom 0.711: 79.35,41.88 C58*.P$1
  Bottom 1.016: 83.08,42.14 79.35,41.88 | Q2.3 83.08,42.14 | 83.08,42.14 82.86,44.93 83.03,52.22 84.81,53.82 R124*.2 | R126*.1 80.14,45.62 C58*.P$1
N$178
  Bottom 0.711: 3.91,54.48 DECAY.3 3.91,54.76 | 3.91,59.51 DECAY.2
  Bottom 1.016: R93*.1 52.83,39.73 49.73,40.79 48.9,40.79 46.61,41.55 45.34,46.35 44.22,46.97 31.85,46.97 28.12,44.76 22.17,44.76 11.94,54.48 3.91,54.48 | 3.91,54.76 3.91,59.51
N$216
  Bottom 0.711: 45.31,50.85 R95*.1 | 49.45,51.97 Q4.3
  Bottom 1.016: 45.31,50.85 48.08,51.36 49.45,51.97
N$223
  Bottom 0.711: 54.76,31.27 C51*.P$1 | 56.49,32.13 R91*.2 56.77,32.66 | 68.45,62.03 D11*.A | 68.73,62.31 D11*.A | 68.99,62.33 D11*.A
  Bottom 1.016: 54.76,31.27 55.88,31.77 56.49,32.13 | 68.45,62.03 68.4,60.96 67.79,59.18 C50*.P$2 65.53,56.11 64.26,49.76 62.31,47.8 62.05,40.26 57.02,37.77 56.77,32.66 | R90*.1 71.12,63.2 68.99,62.33
N$495
  Bottom 0.711: 20.5,67.31 20.4,67.72 R55*.1
  Bottom 1.016: 20.5,67.31 20.5,69.9 C11*.P$2
N$496
  Bottom 0.711: 20.4,59.64 R55*.2
  Bottom 1.016: C15*.P$1 28.8,58.22 R59*.1 | 20.4,59.64 20.65,59.05 22.45,56.74 25.68,56.74 R59*.1 | IC4.2 27.43,59.82 R59*.1
N$498
  Bottom 0.711: 35.76,62.03 R100*.1
  Bottom 0.813: 48.64,59.38 Q5.2
  Bottom 1.016: 48.64,59.38 46.38,58.4 44.2,58.4 C44*.2 42.65,58.65 40.03,61.77 35.76,62.03
N$500
  Bottom 0.711: C43*.P$2 59.79,64.26 59.79,63.42 59.51,63.42 | 60.91,62.31 D11*.C
  Bottom 1.016: 60.91,62.31 59.79,63.42 | 59.51,63.42 57.38,62.56 53.9,61.54 Q5.1
N$501
  Bottom 0.711: 73.13,68.38 73.46,68.56 R88*.2
  Bottom 1.016: 73.13,68.38 69.6,66.6 R90*.2 68.05,65.84 66.98,67.31 C39*.+
N$502
  Bottom 0.711: 24.87,76 C10*.P$2
  Bottom 1.016: 24.87,76 25.88,75.59 26.42,71.75 R52*.1
N$503
  Bottom 0.711: 30.73,68.73 IC4.6 | 40.77,73.08 C13*.P$1 | 31.98,70.99 R52*.2 | 35.08,75.49 R57*.1
  Bottom 1.016: 30.73,68.73 30.94,69.95 R52*.2 | 40.77,73.08 39.04,75.11 37.13,75.49 R57*.1 | 31.98,70.99 34.52,71.35 34.65,73.76 34.65,74.3 35.08,75.49
N$504
  Bottom 0.711: 30.35,75.72 30.07,75.74 R57*.2 | 32.13,73.76 C14*.P$2 32.13,73.48 | 27.94,68.73 IC4.7 | 40.89,77.42 C46*.1
  Bottom 1.016: 32.13,73.76 30.35,75.72 30.89,77.24 34.62,77.42 40.89,77.42 | 27.94,68.73 29.59,72.67 32.13,73.48
N$505
  Bottom 0.711: 46.43,77.39 C46*.2 | 54.56,73.2 54.48,73.2 Q1.2
  Bottom 1.016: 46.33,75.56 46.33,76.28 46.43,77.39 | 46.33,75.56 46.33,72.9 R102*.1 | 54.56,73.2 50.67,75.56 46.33,75.56
N$507
  Bottom 0.711: 65.08,73.76 66.04,74.02 D12*.C 67.06,74.04 | 55.88,71.25 Q1.1
  Bottom 1.016: 55.88,71.25 56.72,71.5 65.08,73.76
N$508
  Bottom 0.711: 74.6,74.04 D12*.A 74.88,74.04
  Bottom 1.016: C48*.P$1 87.53,71.14 85.88,71.65 84.1,71.14 R104*.1 81.03,70.64 77.83,73.53 74.88,74.04
N$510
  Bottom 0.711: 85.75,68.83 D7*.C | 81.81,66.67 81.79,66.95 C40*.+
  Bottom 1.016: R88*.1 79.27,68.05 79.88,67.54 81.81,66.67 83.44,67.03 D7*.C
N$511
  Bottom 0.711: 69.85,38 R86*.2
  Bottom 1.016: 69.85,38 70.69,36.65 R85*.1 | R86*.2 C35*.+
N$512
  Bottom 0.813: 80.82,35.56 80.75,35.64
  Bottom 1.016: 80.75,35.64 80.06,35.64 R85*.2 | Q7.1 80.82,35.56
N$513
  Bottom 0.711: 86.61,30.73 D8*.A | 87.33,58.17 D6*.A 87.58,58.7 86.82,58.29 | 85.9,61.19 D7*.A 85.67,61.21
  Bottom 1.016: 86.61,30.73 86.61,32 87.63,33.02 87.63,34.29 Q7.3 86.46,35.56 88.09,41.25 88.09,49.3 87.12,53.09 D6*.A | 85.9,61.19 86.82,58.29
N$514
  Bottom 0.813: 83.82,25.63 R84*.1 | 83.82,32.41 83.84,32.41
  Bottom 1.016: 83.82,32.41 83.82,25.63 | 83.84,32.41 Q7.2
N$515
  Bottom 0.711: 71.14,11.46 70.97,11.46 Q8.1 71.25,11.48 | 67.33,12.57 R83*.2
  Bottom 1.016: 71.14,11.46 69.01,12.57 67.33,12.57 | R84*.2 75.74,11.48 71.25,11.48
N$516
  Bottom 0.711: 60.35,3.91 R10*.2 | 65.94,5.03 R15*.1 66.22,5.31 | 69.01,10.06 Q8.2
  Bottom 1.016: 60.35,3.91 60.71,4.93 62.59,5.03 65.94,5.03 | 69.01,10.06 68,8.36 66.22,5.31
N$517
  Bottom 0.711: 58.4,7.82 R6*.2 58.67,7.82 | 56.72,7.82 Q3.2 | 62.03,7.82 R3*.1
  Bottom 1.016: 56.72,7.82 58.4,7.82 | 58.67,7.82 62.03,7.82
N$522
  Bottom 0.711: 57.02,47.07 D5*.C | 56.44,54.48 C36*.P$1 57,54.48 56.52,54.2
  Bottom 1.016: 56.44,54.48 54.74,52.7 Q4.1 | 56.52,54.2 56.52,48.62 D5*.C
N$523
  Bottom 0.711: 67.61,53.09 C47*.1 67.61,52.81 | 70.61,53.77 R94*.2 | 64.24,44.07 C49*.P$1 | 67.06,47.04 D5*.A
  Bottom 0.813: 67.36,47.07 D5*.A
  Bottom 1.016: 67.61,53.09 69.01,53.59 70.61,53.77 | 64.24,44.07 65.25,45.49 67.06,47.04 | 67.59,46.81 D5*.A | 67.36,47.07 67.61,52.81
N$524
  Bottom 0.711: 50.57,54.2 Q4.2 | 45.82,55.6 R96*.1
  Bottom 1.016: R96*.1 44.5,55.37 C42*.2 | 50.57,54.2 48.23,54.71 45.82,55.6
N$526
  Bottom 0.711: 73.91,54.03 R87*.2 | 77.39,54.48 C37*.+
  Bottom 1.016: 73.91,54.03 75.41,54.28 77.39,54.48
N$527
  Bottom 0.711: 77.14,23.52 77.65,23.42 Q6.3 | 76.28,27.94 R105*.2 | 77.27,23.37 76.17,25.32
  Bottom 0.813: 76.28,25.15 77.14,23.52
  Bottom 1.016: 76.28,27.94 76.28,25.15 77.27,23.37 | 76.17,25.32 68.35,25.32 R92*.2
N$528
  Bottom 0.711: 63.55,29.21 R89*.2 | 66.95,31.5 67.31,31.6 R92*.1 | 64.31,32.13 R91*.1
  Bottom 1.016: 66.95,31.5 63.55,29.21 64.31,32.13
N$529
  Bottom 0.711: 78.79,30.38 78.79,30.45 D8*.C | 78.79,25.63 Q6.2 | 60.63,35.2 R93*.2 | 60.91,27.38 60.63,27.38
  Bottom 0.813: 60.91,27.38 62.79,27.28
  Bottom 1.016: 78.79,25.63 78.79,30.38 75.79,30.38 71.93,27.28 62.79,27.28 | 60.63,35.2 60.63,27.38 59.18,26.19 C41*.+
N$530
  Bottom 0.711: 57.84,43.31 C53*.P$1 | 60.35,43.56 C49*.P$2 | 59.51,40.97 R106*.1
  Bottom 1.016: 60.35,43.56 59.51,43.31 | 59.51,43.31 57.84,43.31 | 59.51,43.31 59.51,40.97
N$531
  Bottom 0.711: 49.45,38.84 C54*.P$2 | 33.25,38 IC2.3 32.97,38.28
  Bottom 1.016: 49.45,38.84 42.75,38.84 39.65,35.99 33.98,35.99 33.25,38 | 32.97,38.28 32.26,40.26 R109*.1
N$532
  Bottom 0.711: 3.91,46.66 TONE.1
  Bottom 1.016: 3.91,46.66 8.69,45.31 R119*.1 R112*.2
N$533
  Bottom 0.711: 43.16,44.2 43.16,45.03 R108*.2 | 44.17,41.91 R110*.2 | 24.87,42.19 C55*.1 | 38,38.28 IC2.1
  Bottom 0.813: 38,38.28 38.28,38.28
  Bottom 1.016: 44.17,41.91 43.16,44.2 39.37,45.21 | 24.87,42.19 26.09,42.19 30.4,43.1 32.77,45.21 39.37,45.21 | 38.28,38.28 39.37,39.37 39.37,45.21
N$534
  Bottom 0.711: 49.45,42.47 C54*.P$1 | 53.92,43.31 C53*.P$2
  Bottom 0.813: 49.45,43.31 49.45,42.47
  Bottom 1.016: R108*.1 48.44,44.53 49.45,43.31 53.92,43.31
N$535
  Bottom 0.711: 34.37,43.03 R111*.2
  Bottom 1.016: 34.37,43.03 34.44,43.03 R110*.1 36.58,41.4 35.56,38.35 IC2.2
N$536
  Bottom 0.711: 15.11,39.42 R112*.1
  Bottom 1.016: C55*.2 16.51,40.31 15.11,39.42
N$537
  Bottom 0.711: 3.91,36.88 TONE.3
  Bottom 1.016: 3.91,36.88 7.54,33.25 R125*.1
N$538
  Bottom 0.711: 50.7,31.01 C52*.P$2 | 33.25,30.73 IC2.6
  Bottom 0.813: 43.16,32.74 R113*.1
  Bottom 1.016: 50.7,31.01 49.84,31.01 47.27,32.56 R113*.1 | 33.25,30.73 34.49,32.74 43.16,32.74
N$539
  Bottom 0.711: 28.75,21.41 R114*.2 | 35.48,30.45 IC2.7 | 47.42,25.98 47.6,25.4 47.6,25.2 R107*.2
  Bottom 1.016: 28.75,21.41 30.45,21.59 31.83,22.1 C56*.P$1 35.41,24.18 35.48,25.02 35.48,28.73 | 35.48,28.73 35.48,30.45 | 47.42,25.98 46.66,27.38 45.57,28.73 35.48,28.73
N$540
  Bottom 0.711: 54.48,27.66 C51*.P$2 | 52.63,25.7 R107*.1
  Bottom 1.016: 54.48,27.66 52.25,27.66 C52*.P$1 51.46,27.36 52.12,26.24 52.63,25.7
N$541
  Bottom 0.711: 33.1,25.43 33.17,25.5 R115*.2 | 30.45,30.45 IC2.5
  Bottom 1.016: 33.1,25.43 30.71,26.19 | 30.71,26.19 28.75,26.19 R114*.1 | 30.71,26.19 30.45,30.45
N$544
  Bottom 0.711: 26.54,11.18 C77*.1 26.82,11.46 | 30.18,11.46 R128*.1 | 38,12.57 IC1.2
  Bottom 1.016: 13.73,27.73 18.92,21.84 26.54,11.18 | 13.73,27.73 12.83,28.75 12.83,29.74 C90*.P$2 | 26.82,11.46 30.18,11.46 | 38,12.57 37.36,10.41 30.94,10.41 R128*.1 | C78*.- 11.18,25.17 13.73,27.73
N$546
  Bottom 0.711: 16.48,19 R166*.1 16.2,19.28 | 26.82,8.66 C77*.2 27.1,8.66 | 30.18,6.71 R128*.2 | 35.69,5.31 35.48,5.31 IC1.6 | 3.91,26.54 LEVEL.1
  Bottom 0.813: 16.2,19.28 16.26,19.53
  Bottom 1.016: 26.82,8.66 22.61,9.65 21.84,13.66 16.48,19 | 30.18,6.71 29.06,6.71 27.1,8.66 | 35.69,5.31 34.8,7.21 30.71,7.21 R128*.2 | 3.91,26.54 8.69,23.5 13.97,23.37 16.26,19.53
N$547
  Bottom 0.711: 38.48,21.87 R120*.1
  Bottom 1.016: 38.48,21.87 37.26,21.36 C56*.P$2
N$548
  Bottom 0.813: 22.86,36.32 R129*.1
  Bottom 1.016: R121*.2 42.75,18.87 41.55,18.62 R120*.2 35.56,17.02 27.18,18.54 26.42,19.3 23.62,29.21 R125*.2 22.86,36.32
N$549
  Bottom 0.711: 12.83,35.15 C90*.P$1
  Bottom 1.016: 12.83,35.15 14.35,35.33 R129*.2 | R119*.2 C90*.P$1
N$550
  Bottom 0.711: 88.8,64.47 C48*.P$2
  Bottom 1.016: C59*.P$1 90.02,47.73 90.02,50.32 R124*.1 89.81,58.6 88.8,64.47
N$551
  Bottom 0.711: 86.28,46.71 86.39,46.71 C59*.P$2 | 85.42,41.76 85.42,41.66
  Bottom 1.016: R127*.1 85.95,48.56 86.28,46.71 86.03,45.16 85.42,41.76 | 85.42,41.66 Q2.2
N$553
  Bottom 0.711: 74.95,41.63 C58*.P$2
  Bottom 1.016: 74.95,41.63 74.95,33.55 R123*.1
N$554
  Bottom 0.711: 51.49,18.75 R121*.1 | 70.23,21.36 70.36,21.36 R123*.2
  Bottom 0.813: 51.49,16.99 C57*.P$1
  Bottom 1.016: 51.49,18.75 51.49,16.99 | 70.23,21.36 68.12,19 54.05,19 R121*.1
N$556
  Bottom 0.711: 25.83,54.36 25.7,54.48 R58*.2 25.98,54.48 | 29.06,54.61 C15*.P$2
  Bottom 0.813: 23.32,54.36 C16*.P$1
  Bottom 1.016: 25.83,54.36 23.32,54.36 | 29.06,54.61 27.38,54.61 25.98,54.48
N$557
  Bottom 0.711: 36.58,72.97 C14*.P$1 | 40.51,68.89 C13*.P$2 41.05,68.86
  Bottom 0.813: 37.44,71.7 R56*.2
  Bottom 1.016: 36.58,72.97 37.44,71.7 40.51,68.89
N$558
  Bottom 0.711: 80.21,76 C45*.+ | 86.61,27.94 R105*.1
  Bottom 1.016: 80.21,76 81.33,75.49 R104*.2 84.43,74.47 88.47,73.38 89.23,72.59 91.82,67.82 91.82,29.34 86.61,27.94
N$561
  Bottom 0.711: 70.61,59.05 R94*.1 | 73.13,59.05 R87*.1 | 80.03,58.42 D6*.C 79.45,58.67 | 76.71,60.38 C38*.+
  Bottom 0.813: 77.24,59.87 C38*.+
  Bottom 1.016: 73.13,59.05 70.61,59.05 | 77.24,59.87 79.45,58.67 | 76.71,60.38 75.64,60.07 74.68,59.82 R87*.1
TO_HH
  Bottom 0.711: 37.9,57.1 C44*.1 | 25.15,61.19 IC4.1 | 24.31,58.67 R59*.2 | 19.86,54.25 19.99,54.63 C16*.P$2
  Bottom 0.813: 37.16,55.88 36.88,56.16
  Bottom 1.016: 37.9,57.1 36.88,56.16 34.65,56.16 30.15,52.17 21.97,51.92 20.37,53.52 19.86,54.25 | 37.16,55.88 C42*.1 | 25.15,61.19 23.75,62.59 19.58,62.59 17.96,61.21 17.96,57.28 18.72,56.26 19.23,54.91 C16*.P$2 | 24.31,58.67 24.31,59.51 25.43,60.63 IC4.1
TRIG*
  Bottom 0.711: 71.25,5.31 R15*.2 | 71.25,8.66 Q8.3 | 91.64,7.82 PWR1.13 91.36,7.54 | 93.88,7.82 PWR1.14
  Bottom 1.016: 71.25,8.66 71.25,7.54 | 71.25,7.54 71.25,5.31 | 93.88,7.82 91.64,7.82 | 91.36,7.54 71.25,7.54
(copper drawn outside any net)
  shapes: Bottom area x1